# Altium schematic sheet uController.SchDoc
size A4; SheetNumber: 2; SheetTotal: 4
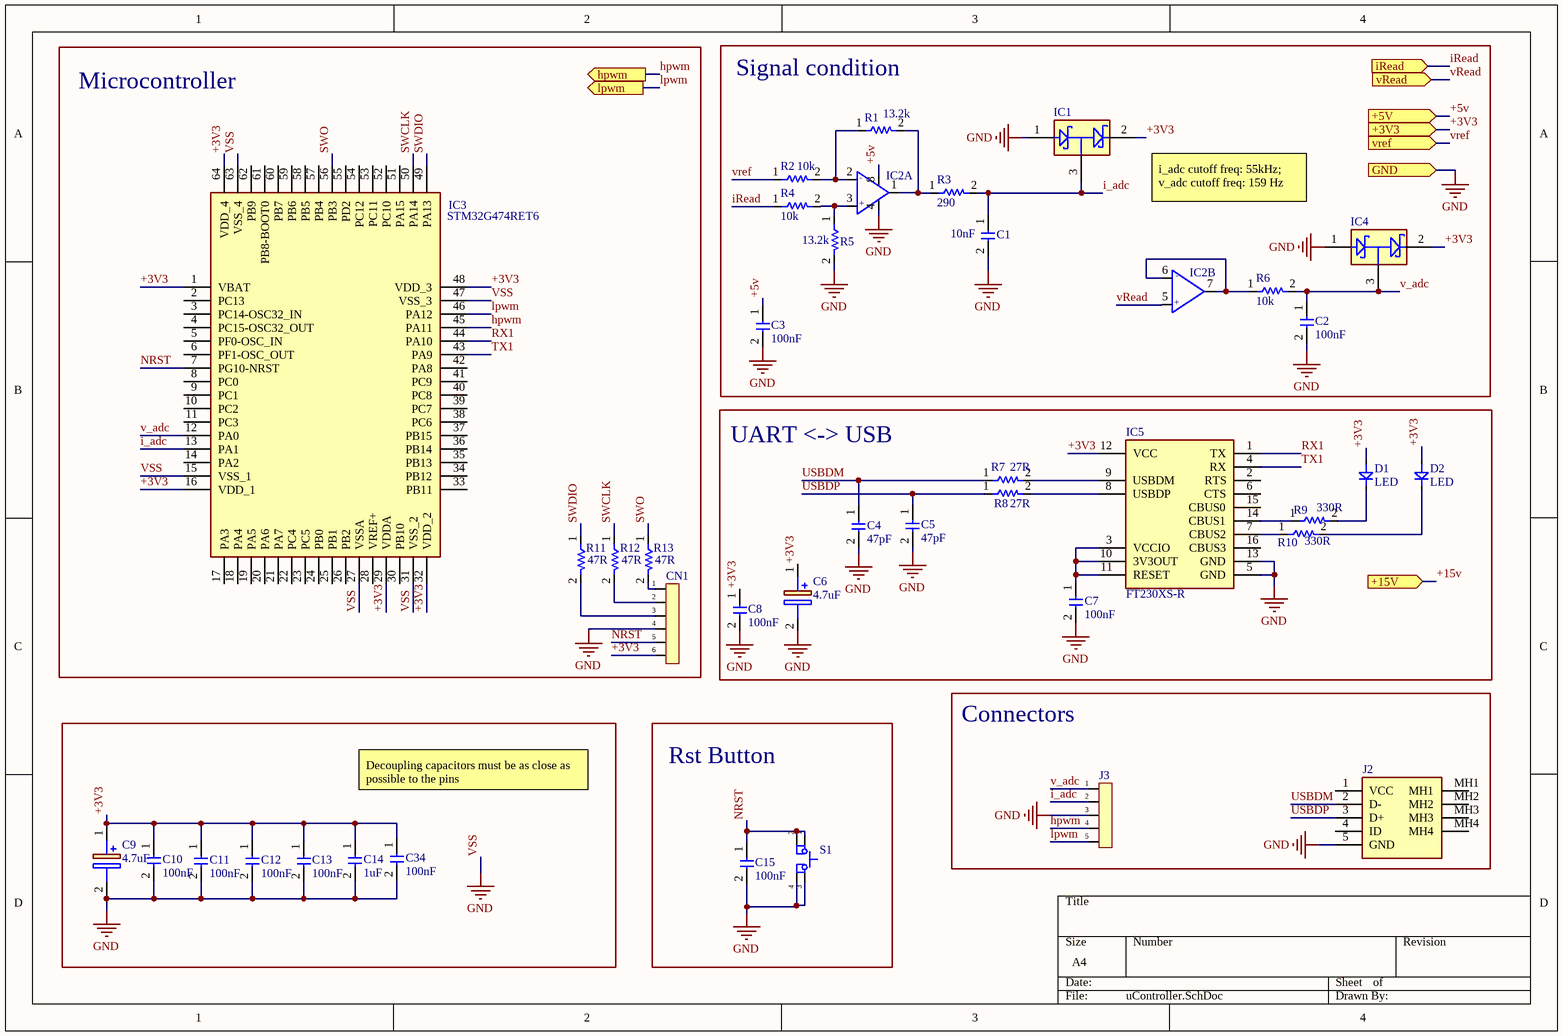
[diagram p0: uController.SchDoc]

## Parts
C1  10nF  [CAPACITOR_0805]
C2  100nF  [CAPACITOR_0805]
C3  100nF  [CAPACITOR_0805]
C4  47pF  [CAPACITOR_0805]
C5  47pF  [CAPACITOR_0805]
C6  4.7uF  [Capacitor 0805 polaryzed]
C7  100nF  [CAPACITOR_0805]
C8  100nF  [CAPACITOR_0805]
C9  4.7uF  [Capacitor 0805 polaryzed]
C10  100nF  [CAPACITOR_0805]
C11  100nF  [CAPACITOR_0805]
C12  100nF  [CAPACITOR_0805]
C13  100nF  [CAPACITOR_0805]
C14  1uF  [CAPACITOR_0805]
C15  100nF  [CAPACITOR_0805]
C34  100nF  [CAPACITOR_0805]
CN1  Conector 1x6P  [Header 2x3]  (value not drawn)
D1  LED  [LED 0805]
D2  LED  [LED 0805]
IC1  bat54s  [BAT54S]  (value not drawn)
IC2  TSX712IDT  [SO-8]  (value not drawn)  (parts A,B of 2)
IC3  STM32G474RET6  [QFP50P1200X1200X160-64N]
IC4  bat54s  [BAT54S]  (value not drawn)
IC5  FT230XS-R  [SSOP-16]
J2  UJ2-MIBH2-4-SMT-TR  [UJ2MIBH24SMTTR]  (value not drawn)
J3  Conector 1x5P  [HEADER 1X5]  (value not drawn)
R1  13.2k  [RESISTOR_0805]
R2  10k  [RESISTOR_0805]
R3  290  [RESISTOR_0805]
R4  10k  [RESISTOR_0805]
R5  13.2k  [RESISTOR_0805]
R6  10k  [RESISTOR_0805]
R7  27R  [RESISTOR_0805]
R8  27R  [RESISTOR_0805]
R9  330R  [RESISTOR_0805]
R10  330R  [RESISTOR_0805]
R11  47R  [RESISTOR_0805]
R12  47R  [RESISTOR_0805]
R13  47R  [RESISTOR_0805]
S1  pushButton  [Push_Button]  (value not drawn)

## Blocks framed on the sheet
Microcontroller: CN1 IC3 R11-R13
Signal condition: C1-C3 IC1 IC2 IC4 R1-R6
UART <-> USB: C4-C8 D1 D2 IC5 R7-R10
Rst Button: C15 S1
Connectors: J2 J3

## Ports
+3V3 (in, see pfc[2B], powerReg[3C]), +5V (in, see pfc[2B], converter[4C], powerReg[3C]), +15V (in, see pfc[2B], converter[4C], powerReg[3B]), GND (in, see pfc[2B], converter[4B], powerReg[3C]), hpwm (out, see pfc[3A], converter[4A]), iRead (in, see pfc[2A], converter[2C]), lpwm (out, see pfc[3B], converter[4A]), vRead (in, see pfc[2B], converter[2C]), vref (in, see pfc[2B], powerReg[3C])

## Nets
VSS: C1.2 C2.2 C3.2 C4.2 C5.2 C6.2(-) C7.2 C8.2 C9.2(-) C10.2 C11.2 C12.2 C13.2 C14.2 C15.2 C34.2 CN1.4 IC1.1(IN) IC2.4 IC3.15(VSS_1) IC3.27(VSSA) IC3.31(VSS_2) IC3.47(VSS_3) IC3.63(VSS_4) IC4.1(IN) IC5.5(GND) IC5.13(GND) J2.5(GND) J3.3 R5.2 S1.3 S1.4 ; port GND  [also labelled GND]
+3V3: C6.1(+) C8.1 C9.1(+) C10.1 C11.1 C12.1 C13.1 C14.1 C34.1 CN1.6 D1.2 D2.2 IC1.2(OUT) IC3.1(VBAT) IC3.16(VDD_1) IC3.29(VDDA) IC3.32(VDD_2) IC3.48(VDD_3) IC3.64(VDD_4) IC4.2(OUT) IC5.12(VCC) ; port +3V3
+5v: C3.1 IC2.8 ; port +5V
+15v: port +15V
hpwm: IC3.45(PA11) J3.4 ; port hpwm
i_adc: C1.1 IC1.3(COM) IC3.13(PA1) J3.2 R3.2
iRead: R4.1 ; port iRead
lpwm: IC3.46(PA12) J3.5 ; port lpwm
NRST: C15.1 CN1.5 IC3.7(PG10-NRST) S1.1 S1.2
RX1: IC3.44(PA10) IC5.1(TX)
SWCLK: IC3.50(PA14) R12.1
SWDIO: IC3.49(PA13) R11.1
SWO: IC3.56(PB3) R13.1
TX1: IC3.43(PA9) IC5.4(RX)
USBDM: C4.1 J2.2(D-) R7.1
USBDP: C5.1 J2.3(D+) R8.1
v_adc: C2.1 IC3.12(PA0) IC4.3(COM) J3.1 R6.2
vRead: IC2.5 ; port vRead
vref: R2.1 ; port vref
NetC7_1: C7.1 IC5.3(VCCIO) IC5.10(3V3OUT) IC5.11(RESET)
NetCN1_1: CN1.1 R13.2
NetCN1_2: CN1.2 R12.2
NetCN1_3: CN1.3 R11.2
NetD1_1: D1.1 R9.2
NetD2_1: D2.1 R10.2
NetIC2_1: IC2.1 R1.2 R3.1
NetIC2_2: IC2.2 R1.1 R2.2
NetIC2_3: IC2.3 R4.2 R5.1
NetIC2_6: IC2.6 IC2.7 R6.1
NetIC5_7: IC5.7(CBUS2) R10.1
NetIC5_8: IC5.8(USBDP) R8.2
NetIC5_9: IC5.9(USBDM) R7.2
NetIC5_14: IC5.14(CBUS1) R9.1

Not connected (* = marked no-connect by the designer): IC3 2(PC13) 3(PC14-OSC32_IN) 4(PC15-OSC32_OUT) 5(PF0-OSC_IN) 6(PF1-OSC_OUT) 8(PC0) 9(PC1) 10(PC2) 11(PC3) 14(PA2) 17(PA3) 18(PA4) 19(PA5) 20(PA6) 21(PA7) 22(PC4) 23(PC5) 24(PB0) 25(PB1) 26(PB2) 28(VREF+) 30(PB10) 33(PB11) 34(PB12) 35(PB13) 36(PB14) 37(PB15) 38(PC6) 39(PC7) 40(PC8) 41(PC9) 42(PA8) 51(PA15) 52(PC10) 53(PC11) 54(PC12) 55(PD2) 57(PB4) 58(PB5) 59(PB6) 60(PB7) 61(PB8-BOOT0) 62(PB9); IC5 2(RTS) 6(CTS) 15(CBUS0) 16(CBUS3); J2 1(VCC) 4(ID) MH1 MH2 MH3 MH4

## Notes on the sheet
- i_adc cutoff freq: 55kHz; v_adc cutoff freq: 159 Hz
- Decoupling capacitors must be as close as possible to the pins
- (in symbol TSX712IDT, part A) -; +
- (in symbol TSX712IDT, part B) -; +

## Library data of the parts
C1-C5 C7 C8 C10-C15 C34 = Capacitor
C6 C9 = Capacitor polaryzed
IC3 = STM32G474RET6: Integrated Circuit; Manufacturer_Name: STMicroelectronics; Datasheet Link: https://www.st.com/resource/en/datasheet/stm32g474re.pdf; Height: 1.6mm; Manufacturer_Part_Number: STM32G474RET6; Mouser Part Number: 511-STM32G474RET6; Mouser Price/Stock: https://www.mouser.co.uk/ProductDetail/STMicroelectronics/STM32G474RET6?qs=PzGy0jfpSMvUBs7PMTDqlg%3D%3D; Arrow Part Number: STM32G474RET6; Arrow Price/Stock: https://www.arrow.com/en/products/stm32g474ret6/stmicroelectronics?region=nac
J2 = UJ2-MIBH2-4-SMT-TR: Connector; Manufacturer_Name: CUI Devices; Datasheet Link: https://www.cui.com/product/resource/digikeypdf/uj2-mibh2-4-smt.pdf; Height: 2.5mm; Manufacturer_Part_Number: UJ2-MIBH2-4-SMT-TR; Mouser Part Number: 490-UJ2-MIBH2-4-SMT; Mouser Price/Stock: https://www.mouser.co.uk/ProductDetail/CUI-Devices/UJ2-MIBH2-4-SMT-TR?qs=5mqXD9RfOg1yxHIpPvPxvQ%3D%3D; Arrow Part Number: UJ2-MIBH2-4-SMT-TR; Arrow Price/Stock: https://www.arrow.com/en/products/uj2-mibh2-4-smt-tr/cui-devices?region=nac
R1-R13 = Resistor